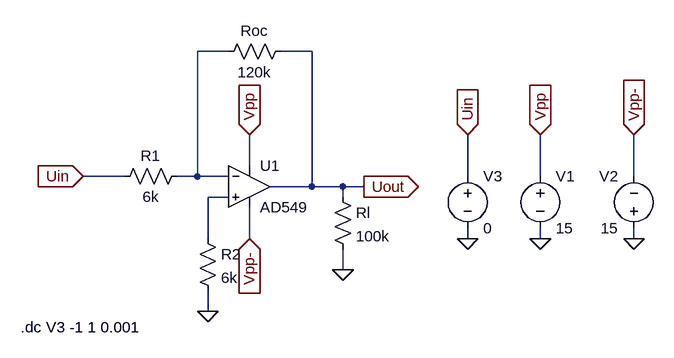
[diagram p0: schematic Task1.asc]
Task1.asc, the LTspice schematic file:
Version 4
SHEET 1 1160 680
WIRE 128 -16 80 -16
WIRE 256 -16 208 -16
WIRE 160 160 160 112
WIRE -32 176 -96 176
WIRE 80 176 80 -16
WIRE 80 176 48 176
WIRE 128 176 80 176
WIRE 496 176 496 112
WIRE 608 176 608 112
WIRE 752 176 752 112
WIRE 256 192 256 -16
WIRE 256 192 192 192
WIRE 304 192 256 192
WIRE 336 192 304 192
WIRE 128 208 96 208
WIRE 304 208 304 192
WIRE 96 272 96 208
WIRE 160 272 160 224
WIRE 496 272 496 256
WIRE 608 272 608 256
WIRE 752 272 752 256
WIRE 304 320 304 288
WIRE 96 384 96 352
FLAG 496 112 Uin
IOPIN 496 112 In
FLAG -96 176 Uin
IOPIN -96 176 In
FLAG 336 192 Uout
IOPIN 336 192 Out
FLAG 160 112 Vpp
IOPIN 160 112 In
FLAG 160 272 Vpp-
IOPIN 160 272 In
FLAG 96 384 0
FLAG 304 320 0
FLAG 608 112 Vpp
IOPIN 608 112 In
FLAG 752 112 Vpp-
IOPIN 752 112 In
FLAG 496 272 0
FLAG 608 272 0
FLAG 752 272 0
SYMBOL OpAmps\\AD549 160 128 R0
SYMATTR InstName U1
SYMBOL res 80 256 R0
SYMATTR InstName R2
SYMATTR Value 6k
SYMBOL res 64 160 R90
WINDOW 0 0 56 VBottom 2
WINDOW 3 32 56 VTop 2
SYMATTR InstName R1
SYMATTR Value 6k
SYMBOL res 288 192 R0
SYMATTR InstName Rl
SYMATTR Value 100k
SYMBOL res 224 -32 R90
WINDOW 0 0 56 VBottom 2
WINDOW 3 32 56 VTop 2
SYMATTR InstName Roc
SYMATTR Value 120k
SYMBOL voltage 496 160 R0
SYMATTR InstName V3
SYMATTR Value 0
SYMBOL voltage 608 160 R0
SYMATTR InstName V1
SYMATTR Value 15
SYMBOL voltage 752 272 R180
WINDOW 0 24 96 Left 2
WINDOW 3 24 16 Left 2
SYMATTR InstName V2
SYMATTR Value 15
TEXT -192 408 Left 2 !.dc V3 -1 1 0.001

The netlist it stands for:
* Task1.asc
XU1 N002 N001 Vpp Vpp- Uout AD549  ; pins In+ In- V+ V- OUT
R2 N002 0 6k
R1 N001 Uin 6k
Rl Uout 0 100k
Roc Uout N001 120k
V3 Uin 0 0
V1 Vpp 0 15
V2 0 Vpp- 15
.dc V3 -1 1 0.001
.backanno
.end